# EAGLE schematic Sound (EAGLE 9.6.2)
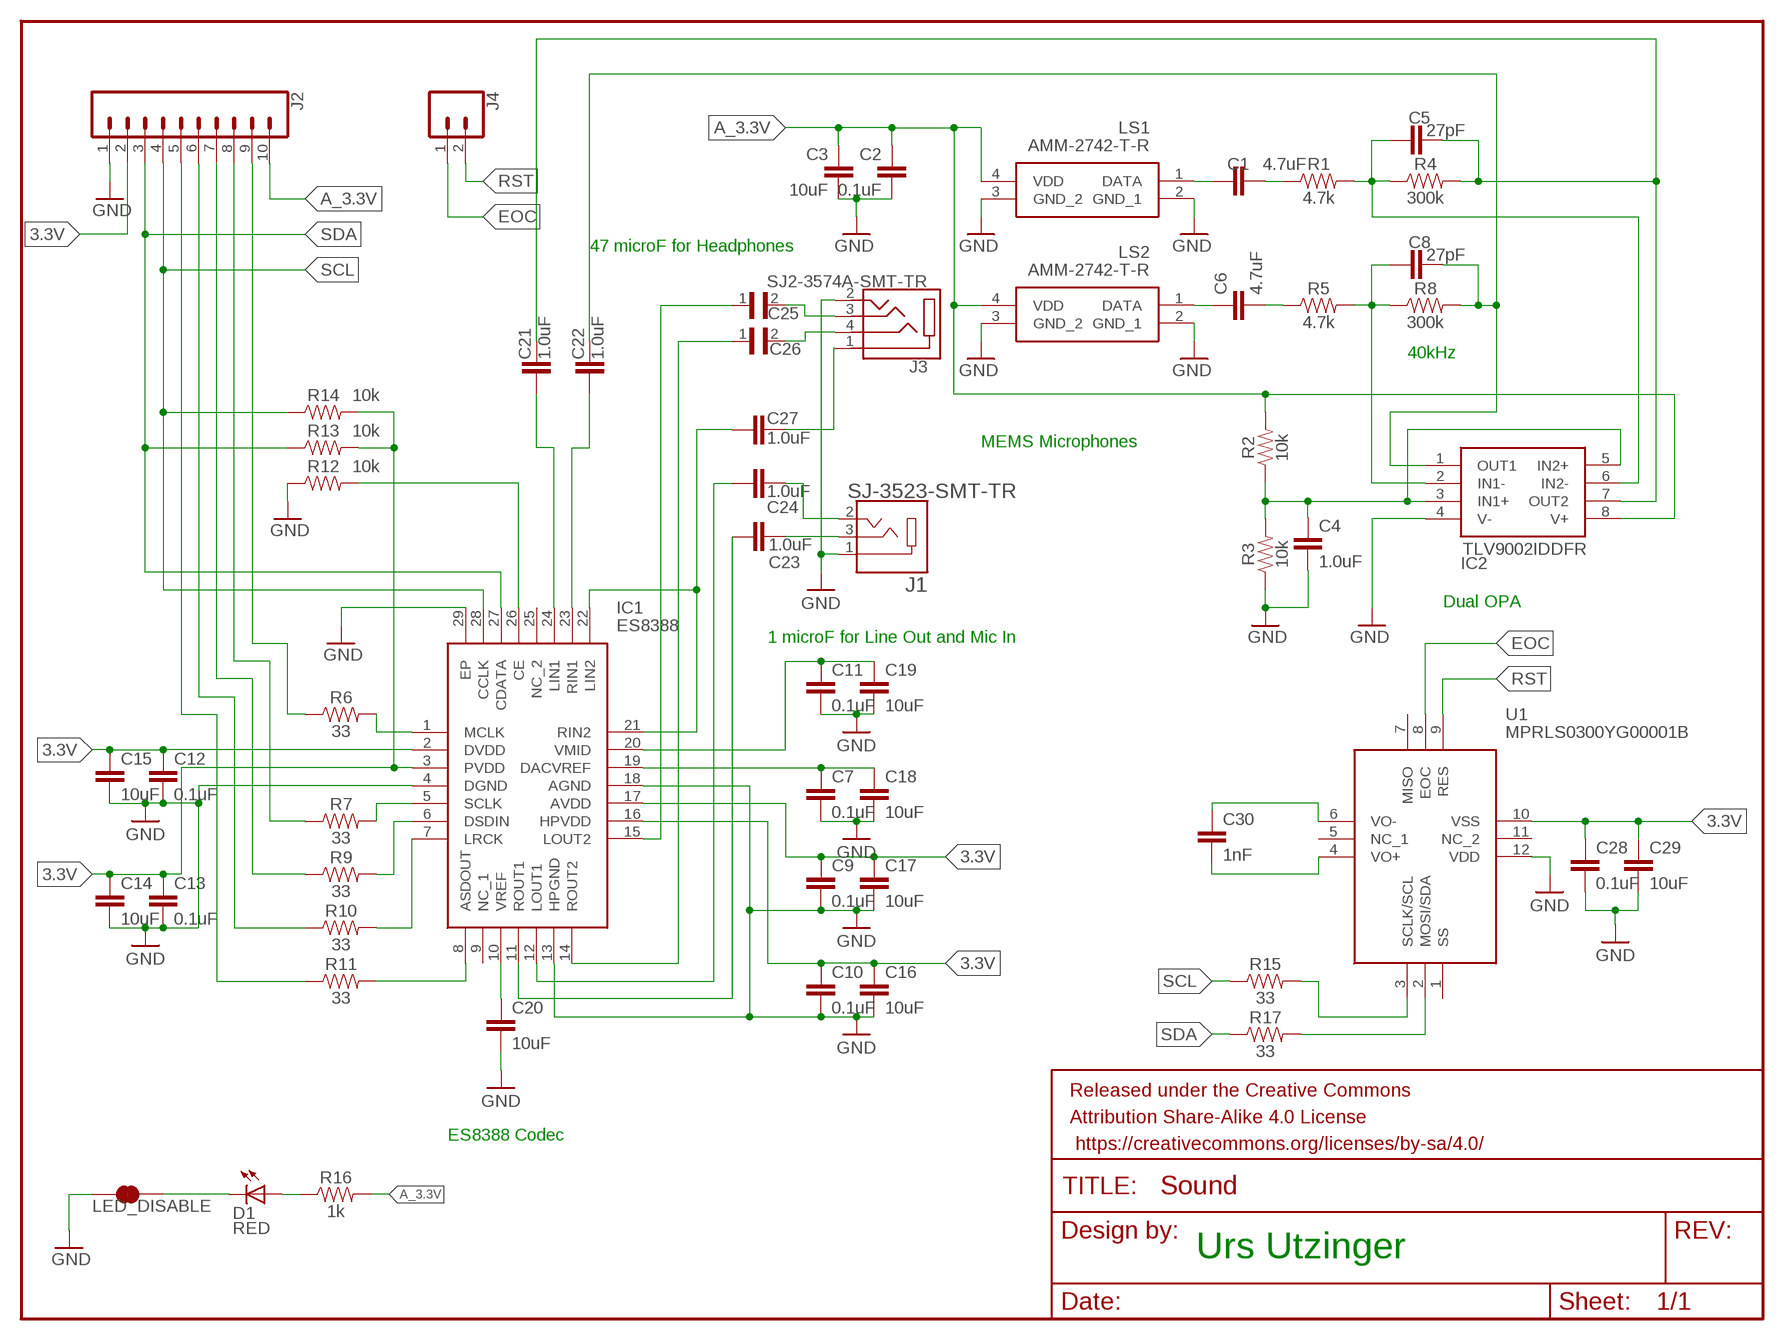
[diagram p0: schematic, sheet 1]

## Parts
C1  4.7uF  4.7UF-0603-6.3V-(10%)  [0603]
C2  0.1uF  0.1UF-0603-25V-5%  [0603]
C3  10uF  10UF-0603-6.3V-20%  [0603]
C4  1.0uF  1.0UF-0603-16V-10%  [0603]
C5  27pF  27PF-0603-50V-5%  [0603]
C6  4.7uF  4.7UF-0603-6.3V-(10%)  [0603]
C7  0.1uF  0.1UF-0603-25V-5%  [0603]
C8  27pF  27PF-0603-50V-5%  [0603]
C9  0.1uF  0.1UF-0603-25V-5%  [0603]
C10  0.1uF  0.1UF-0603-25V-5%  [0603]
C11  0.1uF  0.1UF-0603-25V-5%  [0603]
C12  0.1uF  0.1UF-0603-25V-5%  [0603]
C13  0.1uF  0.1UF-0603-25V-5%  [0603]
C14  10uF  10UF-0603-6.3V-20%  [0603]
C15  10uF  10UF-0603-6.3V-20%  [0603]
C16  10uF  10UF-0603-6.3V-20%  [0603]
C17  10uF  10UF-0603-6.3V-20%  [0603]
C18  10uF  10UF-0603-6.3V-20%  [0603]
C19  10uF  10UF-0603-6.3V-20%  [0603]
C20  10uF  10UF-0603-6.3V-20%  [0603]
C21  1.0uF  1.0UF-0603-16V-10%  [0603]
C22  1.0uF  1.0UF-0603-16V-10%  [0603]
C23  1.0uF  1.0UF-0603-16V-10%  [0603]
C24  1.0uF  1.0UF-0603-16V-10%  [0603]
C25  GRM188R60J476ME15D  [CAPC1608X100N]
C26  GRM188R60J476ME15D  [CAPC1608X100N]
C27  1.0uF  1.0UF-0603-16V-10%  [0603]
C28  0.1uF  0.1UF-0603-25V-5%  [0603]
C29  10uF  10UF-0603-6.3V-20%  [0603]
C30  1nF  1.0NF/1000PF-0603-50V-10%  [0603]
D1  RED  LED-RED0603  [LED-0603]
FRAME1  FRAME-LETTERNO_PACKAGE  [DUMMY]
IC1  ES8388  [QFN45P400X400X90-29N]
IC2  TLV9002IDDFR  [SOT65P280X110-8N]
J1  SJ-3523-SMT-TR  [CUI_SJ-3523-SMT-TR]
J2  CONN_10"  [1X10]
J3  SJ2-3574A-SMT-TR  [CUI_SJ2-3574A-SMT-TR]
J4  CONN_02  [1X02]
LED_DISABLE  JUMPER-SMT_2_NC_TRACE_SILK  [SMT-JUMPER_2_NC_TRACE_SILK]
LS1  AMM-2742-T-R  [AMM2742TR]
LS2  AMM-2742-T-R  [AMM2742TR]
R1  4.7k  4.7KOHM-0603-1/10W-1%  [0603]
R2  10k  10KOHM-0603-1/10W-1%  [0603]
R3  10k  10KOHM-0603-1/10W-1%  [0603]
R4  300k  300KOHM-0603-1/10W-1%  [0603]
R5  4.7k  4.7KOHM-0603-1/10W-1%  [0603]
R6  33  33OHM-0603-1/10W-1%  [0603]
R7  33  33OHM-0603-1/10W-1%  [0603]
R8  300k  300KOHM-0603-1/10W-1%  [0603]
R9  33  33OHM-0603-1/10W-1%  [0603]
R10  33  33OHM-0603-1/10W-1%  [0603]
R11  33  33OHM-0603-1/10W-1%  [0603]
R12  10k  10KOHM-0603-1/10W-1%  [0603]
R13  10k  10KOHM-0603-1/10W-1%  [0603]
R14  10k  10KOHM-0603-1/10W-1%  [0603]
R15  33  33OHM-0603-1/10W-1%  [0603]
R16  1k  1KOHM-0603-1/10W-1%  [0603]
R17  33  33OHM-0603-1/10W-1%  [0603]
U1  MPRLS0300YG00001B  [MPRLS0300YG00001B]

## Nets
3.3V: C9.1 C10.1 C12.1 C13.1 C14.1 C15.1 C16.1 C17.1 C28.1 C29.1 IC1.2(DVDD) IC1.3(PVDD) IC1.16(HPVDD) IC1.17(AVDD) J2.2 R13.2 R14.2 U1.10(VSS)
A_3.3V: C2.1 C3.1 IC2.8(V+) J2.10 LS1.4(VDD) LS2.4(VDD) R2.2 R16.2
DIN: J2.7 R9.1
DOUT: J2.5 R11.1
EOC: J4.1 U1.8(EOC)
GND: C2.2 C3.2 C4.2 C7.2 C9.2 C10.2 C11.2 C12.2 C13.2 C14.2 C15.2 C16.2 C17.2 C18.2 C19.2 C20.2 C28.2 C29.2 IC1.4(DGND) IC1.13(HPGND) IC1.18(AGND) IC1.29(EP) IC2.4(V-) J1.1 J2.1 J3.2 LED_DISABLE.1 LS1.2(GND_1) LS1.3(GND_2) LS2.2(GND_1) LS2.3(GND_2) R3.1 R12.1 U1.12(VDD)
LRCLK: J2.6 R10.1
MCLK: J2.9 R6.1
N$1: IC1.26(CE) R12.2
N$2: C8.2 C22.2 IC2.1(OUT1) R8.2
N$3: C22.1 IC1.23(RIN1)
N$4: C21.1 IC1.24(LIN1)
N$6: R17.2 U1.2(MOSI/SDA)
N$7: R15.2 U1.3(SCLK/SCL)
N$8: C11.1 C19.1 IC1.20(VMID)
N$9: C30.1 U1.6(VO-)
N$10: C5.2 C21.2 IC2.7(OUT2) R4.2
N$11: C30.2 U1.4(VO+)
N$12: C1.1 LS1.1(DATA)
N$14: C1.2 R1.1
N$15: C5.1 IC2.6(IN2-) R1.2 R4.1
N$16: C4.1 IC2.3(IN1+) IC2.5(IN2+) R2.1 R3.2
N$18: C6.1 LS2.1(DATA)
N$19: C6.2 R5.1
N$20: C8.1 IC2.2(IN1-) R5.2 R8.1
N$21: IC1.8(ASDOUT) R11.2
N$22: IC1.7(LRCK) R10.2
N$23: C20.1 IC1.10(VREF)
N$24: IC1.6(DSDIN) R9.2
N$25: IC1.5(SCLK) R7.2
N$26: D1.A R16.1
N$27: IC1.1(MCLK) R6.2
N$28: D1.C LED_DISABLE.2
N$29: C23.2 IC1.11(ROUT1)
N$30: C24.1 J1.2
N$31: C7.1 C18.1 IC1.19(DACVREF)
N$32: C24.2 IC1.12(LOUT1)
N$34: C25.2 J3.3
N$35: C23.1 J1.3
N$36: C26.2 J3.4
N$37: C27.2 J3.1
N$38: C27.1 IC1.21(RIN2) IC1.22(LIN2)
N$39: C26.1 IC1.14(ROUT2)
N$40: C25.1 IC1.15(LOUT2)
RST: J4.2 U1.9(RES)
SCL: IC1.28(CCLK) J2.4 R14.1 R15.1
SCLK: J2.8 R7.1
SDA: IC1.27(CDATA) J2.3 R13.1 R17.1
Unconnected: IC1.9(NC_1) IC1.25(NC_2) U1.1(SS) U1.5(NC_1) U1.7(MISO) U1.11(NC_2)

## Notes on the sheet
- 47 microF for Headphones
- 40kHz
- MEMS Microphones
- Dual OPA
- 1 microF for Line Out and Mic In
- ES8388 Codec
- Urs Utzinger

## Library data of the parts
C1 C6 = SparkFun-Capacitors:4.7UF: 4.7µF ceramic capacitors A capacitor is a passive two-terminal electrical component used to store electrical energy temporarily in an electric field.; PROD_ID: CAP-08280
C2 C7 C9-C13 C28 = SparkFun-Capacitors:0.1UF: 0.1µF ceramic capacitors A capacitor is a passive two-terminal electrical component used to store electrical energy temporarily in an electric field.; PROD_ID: CAP-08604
C3 C14-C20 C29 = SparkFun-Capacitors:10UF: 10.0µF ceramic capacitors A capacitor is a passive two-terminal electrical component used to store electrical energy temporarily in an electric field.; PROD_ID: CAP-11015
C4 C21-C24 C27 = SparkFun-Capacitors:1.0UF: 1µF ceramic capacitors A capacitor is a passive two-terminal electrical component used to store electrical energy temporarily in an electric field.; PROD_ID: CAP-00868
C5 C8 = SparkFun-Capacitors:27PF: 27pF ceramic capacitors A capacitor is a passive two-terminal electrical component used to store electrical energy temporarily in an electric field.; PROD_ID: CAP-09989
C25 C26 = GRM188R60J476ME15D:GRM188R60J476ME15D: SMD Capacitor X5R(EIA) with Capacitance: 47uF Tol. 20%. Rated Voltage: 6.3Vdc
C30 = SparkFun-Capacitors:1.0NF/1000PF: 1nF/1,000pF ceramic capacitors A capacitor is a passive two-terminal electrical component used to store electrical energy temporarily in an electric field.; PROD_ID: CAP-07886
D1 = SparkFun-LED:LED-RED: Assorted Red LEDs LilyPad 1206- DIO-09912 1206- DIO-00809 0603- DIO-00819; PROD_ID: DIO-00819
FRAME1 = SparkFun-Aesthetics:FRAME-LETTER: Schematic Frame - Letter Standard 8.5x11 US Letter frame; DESIGNER: Nobody; VERSION: v01
IC1 = ES8388:ES8388: Low Power Stereo Audio CODEC With Headphone Amplifier Source: Datasheet <http://www.everest-semi.com/pdf/ES8388 DS.pdf>; DESCRIPTION: Low Power Stereo Audio CODEC With Headphone Amplifier; HEIGHT: 0.9mm; MANUFACTURER_NAME: Everest; MANUFACTURER_PART_NUMBER: ES8388
IC2 = TLV9002IDDFR:TLV9002IDDFR: Operational Amplifiers - Op Amps 2-Channel, 1MHz, RRIO, 1.8V to 5.5V Operational Amplifier for Cost-Optimized Systems 8-SOT-23-THIN -40 to 125 Source: Datasheet <https://www.ti.com/lit/gpn/TLV9002>; ARROW_PART_NUMBER: TLV9002IDDFR; ARROW_PRICE-STOCK: https://www.arrow.com/en/products/tlv9002iddfr/texas-instruments?region=europe; DESCRIPTION: Operational Amplifiers - Op Amps 2-Channel, 1MHz, RRIO, 1.8V to 5.5V Operational Amplifier for Cost-Optimized Systems 8-SOT-23-THIN -40 to 125; HEIGHT: 1.1mm; MANUFACTURER_NAME: Texas Instruments; MANUFACTURER_PART_NUMBER: TLV9002IDDFR; MOUSER_PART_NUMBER: 595-TLV9002IDDFR; MOUSER_PRICE-STOCK: https://www.mouser.co.uk/ProductDetail/Texas-Instruments/TLV9002IDDFR?qs=mAH9sUMRCtuVJ6NmNV%252Bgrw%3D%3D
J1 = SJ-3523-SMT-TR:SJ-3523-SMT-TR: Audio Jack Connector 3.5 mm Low Profile Surface Mount Stereo Jack, 3 Pin Right-Angle; MF: CUI Inc; STANDARD: Manufacturer recommendations
J2 = SparkFun-Connectors:CONN_10: Multi connection point. Often used as Generic Header-pin footprint for 0.1 inch spaced/style header connections On any of the 0.1 inch spaced packages, you can populate with these: Break Away Headers - Straight <https://www.sparkfun.com/products/116> (PRT-00116) Break Away Male Headers - Right Angle <https://www.sparkfun.com/products/553> (PRT-00553) Female Headers <https://www.sparkfun.com/products/115> (PRT-00115) Break Away Headers - Machine Pin <https://www.sparkfun.com/products/117> (PRT-00117) Break Away Female Headers - Swiss Machine Pin <https://www.sparkfun.com/products/743> (PRT-00743) Arduino Stackable Header - 10 Pin <https://www.sparkfun.com/products/11376> (PRT-11376) For SCREWTERMINALS and SPRING TERMINALS visit here: Screw Terimnals on SparkFun.com <https://www.sparkfun.com/search/results?term=Screw+Terminals> (5mm/3.5mm/2.54mm spacing) This device is also useful as a general connection point to wire up your design to another part of your project. Our various solder wires solder well into these plated through hole pads. Hook-Up Wire - Assortment (Stranded, 22 AWG) <https://www.sparkfun.com/products/11375> (PRT-11375) Hook-Up Wire - Assortment (Solid Core, 22 AWG) <https://www.sparkfun.com/products/11367> (PRT-11367) View the entire wire category on our website here <https://www.sparkfun.com/categories/141> Special notes: Molex polarized connector foot print use with SKU : PRT-08231 with associated crimp pins and housings. 1MM SMD Version SKU: PRT-10208 NOTES ON THE VARIANTS LOCK and LOCK_LONGPADS... This footprint was designed to help hold the alignment of a through-hole component (i.e. 6-pin header) while soldering it into place. You may notice that each hole has been shifted either up or down by 0.005 of an inch from it's more standard position (which is a perfectly straight line). This slight alteration caused the pins (the squares in the middle) to touch the edges of the holes. Because they are alternating, it causes a "brace" to hold the component in place. 0.005 has proven to be the perfect amount of "off-center" position when using our standard breakaway headers. Although looks a little odd when you look at the bare footprint, once you have a header in there, the alteration is very hard to notice. Also,if you push a header all the way into place, it is covered up entirely on the bottom side.; PROD_ID: CONN-11563
J3 = SJ2-3574A-SMT-TR:SJ2-3574A-SMT-TR: 3.5 mm, Stereo, Right Angle, Surface Mount (SMT), Audio Jack Connector; MANUFACTURER: CUI; MAXIMUM_PACKAGE_HEIGHT: 5.3 mm; PARTREV: 1.02; STANDARD: Manufacturer Recommendations
J4 = SparkFun-Connectors:CONN_02: Multi connection point. Often used as Generic Header-pin footprint for 0.1 inch spaced/style header connections On any of the 0.1 inch spaced packages, you can populate with these: Break Away Headers - Straight <https://www.sparkfun.com/products/116> (PRT-00116) Break Away Male Headers - Right Angle <https://www.sparkfun.com/products/553> (PRT-00553) Female Headers <https://www.sparkfun.com/products/115> (PRT-00115) Break Away Headers - Machine Pin <https://www.sparkfun.com/products/117> (PRT-00117) Break Away Female Headers - Swiss Machine Pin <https://www.sparkfun.com/products/743> (PRT-00743) For SCREWTERMINALS and SPRING TERMINALS visit here: Screw Terimnals on SparkFun.com <https://www.sparkfun.com/search/results?term=Screw+Terminals> (5mm/3.5mm/2.54mm spacing) This device is also useful as a general connection point to wire up your design to another part of your project. Our various solder wires solder well into these plated through hole pads. Hook-Up Wire - Assortment (Stranded, 22 AWG) <https://www.sparkfun.com/products/11375> (PRT-11375) Hook-Up Wire - Assortment (Solid Core, 22 AWG) <https://www.sparkfun.com/products/11367> (PRT-11367) View the entire wire category on our website here <https://www.sparkfun.com/categories/141> Special notes: Molex polarized connector foot print use with: PRT-08233 with associated crimp pins and housings. 2.54_SCREWTERM for use with PRT-10571. 3.5mm Screw Terminal footprints for PRT-08084 5mm Screw Terminal footprints for use with PRT-08432
LED_DISABLE = SparkFun-Jumpers:JUMPER-SMT_2_NC_TRACE: Normally closed trace jumper This jumper has a trace between two pads so it's normally closed (NC). Use a razor knife to open the connection. For best results follow the IPC guidelines for cutting traces: Cutout at least 0.063 mm (0.005 in). Remove all loose material to clean up the cut area. Seal the cut with an approved epoxy. Reapply solder to reclose the connection.
LS1 LS2 = AMM-2742-T-R:AMM-2742-T-R: Microphones MICROPHONE OMNI -42 DB 2VDC 150uA Source: Datasheet <https://www.mouser.ca/ProductDetail/PUI-Audio/AMM-2742-T-R?qs=sGAEpiMZZMtcsMZaWNSqu0WLuZO5KII9g8HRN6KfqAJAYTCxL65m3w==>; DESCRIPTION: Microphones MICROPHONE OMNI -42 DB 2VDC 150uA; HEIGHT: 0.9mm; MANUFACTURER_NAME: PUI Audio; MANUFACTURER_PART_NUMBER: AMM-2742-T-R; MOUSER_PART_NUMBER: 665-AMM-2742-T-R; MOUSER_PRICE-STOCK: https://www.mouser.co.uk/ProductDetail/PUI-Audio/AMM-2742-T-R?qs=zhx2xqPtQQyJoGop0O%252BpMA%3D%3D
R1 R5 = SparkFun-Resistors:4.7KOHM: 4.7kΩ resistor A resistor is a passive two-terminal electrical component that implements electrical resistance as a circuit element. Resistors act to reduce current flow, and, at the same time, act to lower voltage levels within circuits. - Wikipedia; PROD_ID: RES-07857
R2 R3 R12-R14 = SparkFun-Resistors:10KOHM: 10kΩ resistor A resistor is a passive two-terminal electrical component that implements electrical resistance as a circuit element. Resistors act to reduce current flow, and, at the same time, act to lower voltage levels within circuits. - Wikipedia; PROD_ID: RES-00824
R4 R8 = SparkFun-Resistors:300KOHM: 300kΩ resistor A resistor is a passive two-terminal electrical component that implements electrical resistance as a circuit element. Resistors act to reduce current flow, and, at the same time, act to lower voltage levels within circuits. - Wikipedia; PROD_ID: RES-10809
R6 R7 R9-R11 R15 R17 = SparkFun-Resistors:33OHM: 33Ω resistor A resistor is a passive two-terminal electrical component that implements electrical resistance as a circuit element. Resistors act to reduce current flow, and, at the same time, act to lower voltage levels within circuits. - Wikipedia; PROD_ID: RES-08270
R16 = SparkFun-Resistors:1KOHM: 1kΩ resistor A resistor is a passive two-terminal electrical component that implements electrical resistance as a circuit element. Resistors act to reduce current flow, and, at the same time, act to lower voltage levels within circuits. - Wikipedia; PROD_ID: RES-07856
U1 = MPRLS0300YG00001B:MPRLS0300YG00001B: Board Mount Pressure Sensors Source: Datasheet <https://sensing.honeywell.com/honeywell-sensing-micropressure-board-mount-pressure-mpr-series-datasheet-32332628-c-en.pdf>; DESCRIPTION: Board Mount Pressure Sensors; HEIGHT: 5mm; MANUFACTURER_NAME: Honeywell; MANUFACTURER_PART_NUMBER: MPRLS0300YG00001B; MOUSER_PART_NUMBER: 785-MPRLS0300YG0001B; MOUSER_PRICE-STOCK: https://www.mouser.co.uk/ProductDetail/Honeywell/MPRLS0300YG00001B?qs=MLItCLRbWszf0bln%252B%2FiVCQ%3D%3D